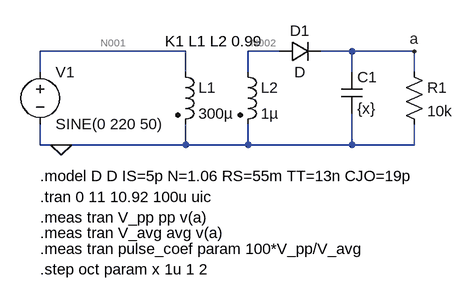
[diagram p0: schematic 1.3.1.asc]
1.3.1.asc, the LTspice schematic file:
Version 4
SHEET 1 880 680
WIRE 320 80 96 80
WIRE 464 80 416 80
WIRE 576 80 528 80
WIRE 672 80 576 80
WIRE 96 112 96 80
WIRE 320 112 320 80
WIRE 416 112 416 80
WIRE 576 112 576 80
WIRE 672 112 672 80
WIRE 96 224 96 192
WIRE 128 224 96 224
WIRE 320 224 320 192
WIRE 320 224 128 224
WIRE 416 224 416 192
WIRE 416 224 320 224
WIRE 576 224 576 176
WIRE 576 224 416 224
WIRE 672 224 672 192
WIRE 672 224 576 224
FLAG 128 224 0
FLAG 672 80 a
SYMBOL voltage 96 96 R0
WINDOW 123 0 0 Left 0
WINDOW 39 0 0 Left 0
SYMATTR InstName V1
SYMATTR Value SINE(0 220 50)
SYMBOL ind2 304 96 R0
SYMATTR InstName L1
SYMATTR Value 300µ
SYMATTR SpiceLine Rser=10m
SYMATTR Type ind
SYMBOL ind2 400 96 R0
SYMATTR InstName L2
SYMATTR Value 1µ
SYMATTR SpiceLine Rser=10m
SYMATTR Type ind
SYMBOL diode 464 96 R270
WINDOW 0 32 32 VTop 2
WINDOW 3 0 32 VBottom 2
SYMATTR InstName D1
SYMBOL cap 560 112 R0
SYMATTR InstName C1
SYMATTR Value {x}
SYMBOL res 656 96 R0
SYMATTR InstName R1
SYMATTR Value 10k
TEXT 96 272 Left 2 !.model D D IS=5p N=1.06 RS=55m TT=13n CJO=19p
TEXT 96 304 Left 2 !.tran 0 11 10.92 100u uic
TEXT 96 336 Left 2 !.meas tran V_pp pp v(a)
TEXT 96 360 Left 2 !.meas tran V_avg avg v(a)
TEXT 96 384 Left 2 !.meas tran pulse_coef param 100*V_pp/V_avg
TEXT 288 64 Left 2 !K1 L1 L2 0.99
TEXT 96 416 Left 2 !.step oct param x 1u 1 2

The netlist it stands for:
* 1.3.1.asc
V1 N001 0 SINE(0 220 50)
L1 N001 0 300µ Rser=10m
L2 N002 0 1µ Rser=10m
D1 N002 a D
C1 a 0 {x}
R1 a 0 10k
.model D D
.lib standard.dio
.model D D IS=5p N=1.06 RS=55m TT=13n CJO=19p
.tran 0 11 10.92 100u uic
.meas tran V_pp pp v(a)
.meas tran V_avg avg v(a)
.meas tran pulse_coef param 100*V_pp/V_avg
K1 L1 L2 0.99
.step oct param x 1u 1 2
.backanno
.end

* Results of the author's LTspice run, read from the files saved beside the schematic
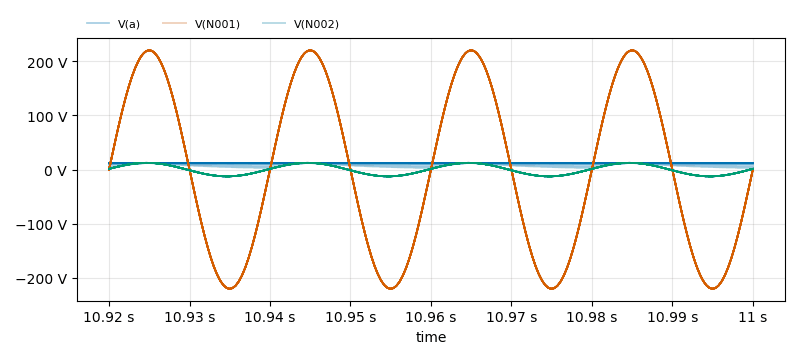
[diagram p1: Transient Analysis of 1.3.1.asc, plotted from the saved traces]
* Transient Analysis, 41 runs:
*   V(a) [run 1]: min 2.614 V, max 11.97 V, average 6.817 V, rms 7.439 V, last 2.728 V
*   V(a) [run 2]: min 5.33 V, max 11.97 V, average 8.513 V, rms 8.754 V, last 5.658 V
*   V(a) [run 3]: min 8.799 V, max 11.97 V, average 10.38 V, rms 10.43 V, last 9.168 V
*   V(a) [run 4]: min 10.67 V, max 11.96 V, average 11.32 V, rms 11.33 V, last 10.88 V
*   V(a) [run 5]: min 11.27 V, max 11.95 V, average 11.61 V, rms 11.62 V, last 11.4 V
*   V(a) [run 6]: min 11.68 V, max 11.92 V, average 11.8 V, rms 11.8 V, last 11.73 V
*   V(a) [run 7]: min 11.81 V, max 11.9 V, average 11.85 V, rms 11.85 V, last 11.83 V
*   V(a) [run 8]: min 11.84 V, max 11.88 V, average 11.86 V, rms 11.86 V, last 11.85 V
*   V(N001) [run 1]: min -220 V, max 220 V, average 24.8 mV, rms 155.6 V, last 0 V
*   V(N001) [run 2]: min -219.9 V, max 220 V, average 22.43 mV, rms 155.6 V, last 0 V
*   V(N001) [run 3]: min -219.9 V, max 220 V, average 24.39 mV, rms 155.6 V, last 0 V
*   V(N001) [run 4]: min -220 V, max 220 V, average 25.59 mV, rms 155.6 V, last 0 V
*   V(N001) [run 5]: min -220 V, max 220 V, average 26.16 mV, rms 155.6 V, last 0 V
*   V(N001) [run 6]: min -219.9 V, max 220 V, average 27.5 mV, rms 155.6 V, last 0 V
*   V(N001) [run 7]: min -219.9 V, max 220 V, average 28.15 mV, rms 155.6 V, last 0 V
*   V(N001) [run 8]: min -220 V, max 220 V, average 27.91 mV, rms 155.6 V, last 0 V
*   V(N002) [run 1]: min -12.5 V, max 12.5 V, average 1.422 mV, rms 8.84 V, last 1.319 V
*   V(N002) [run 2]: min -12.5 V, max 12.5 V, average 1.331 mV, rms 8.84 V, last 1.319 V
*   V(N002) [run 3]: min -12.5 V, max 12.5 V, average 1.434 mV, rms 8.841 V, last 1.319 V
*   V(N002) [run 4]: min -12.5 V, max 12.5 V, average 1.524 mV, rms 8.841 V, last 1.319 V
*   V(N002) [run 5]: min -12.5 V, max 12.5 V, average 1.565 mV, rms 8.841 V, last 1.319 V
*   V(N002) [run 6]: min -12.5 V, max 12.5 V, average 1.661 mV, rms 8.842 V, last 1.319 V
*   V(N002) [run 7]: min -12.5 V, max 12.5 V, average 1.713 mV, rms 8.842 V, last 1.319 V
*   V(N002) [run 8]: min -12.5 V, max 12.5 V, average 1.699 mV, rms 8.842 V, last 1.319 V
* From the log:
*   Measurement: v_pp
*     step  PP(v(a))  FROM  TO
*        1  9.35763  0  0.08
*        2  8.03088  0  0.08
*        3  6.64187  0  0.08
*        4  5.32068  0  0.08
*        5  4.15016  0  0.08
*        6  3.16899  0  0.08
*        7  2.37694  0  0.08
*        8  1.75859  0  0.08
*        9  1.28695  0  0.08
*       10  0.934093  0  0.08
*       11  0.673453  0  0.08
*       12  0.483377  0  0.08
*       13  0.345407  0  0.08
*       14  0.246269  0  0.08
*       15  0.175119  0  0.08
*       16  0.12425  0  0.08
*       17  0.088048  0  0.08
*       18  0.0623465  0  0.08
*       19  0.044116  0  0.08
*       20  0.0312004  0  0.08
*       21  0.022069  0  0.08
*       22  0.0156002  0  0.08
*       23  0.0110397  0  0.08
*       24  0.00780392  0  0.08
*       25  0.00552845  0  0.08
*       26  0.00390244  0  0.08
*       27  0.00275993  0  0.08
*       28  0.00195313  0  0.08
*       29  0.00138092  0  0.08
*       30  0.000977516  0  0.08
*       31  0.000691414  0  0.08
*       32  0.000489235  0  0.08
*       33  0.00034523  0  0.08
*       34  0.000259399  0  0.08
*       35  0.00021553  0  0.08
*       36  0.000210762  0  0.08
*       37  0.00023365  0  0.08
*       38  0.000275612  0  0.08
*       39  0.000340462  0  0.08
*       40  0.00043869  0  0.08
*     ...
*   Measurement: v_avg
*     step  AVG(v(a))  FROM  TO
*        1  6.81733  0  0.08
*        2  7.68613  0  0.08
*        3  8.51273  0  0.08
*        4  9.25031  0  0.08
*        5  9.8755  0  0.08
*        6  10.3842  0  0.08
*        7  10.7846  0  0.08
*        8  11.0916  0  0.08
*        9  11.3218  0  0.08
*       10  11.4911  0  0.08
*       11  11.6134  0  0.08
*       12  11.7003  0  0.08
*       13  11.7605  0  0.08
*       14  11.8012  0  0.08
*       15  11.8277  0  0.08
*       16  11.8439  0  0.08
*       17  11.8532  0  0.08
*       18  11.8582  0  0.08
*       19  11.8609  0  0.08
*       20  11.8623  0  0.08
*       21  11.863  0  0.08
*       22  11.8633  0  0.08
*       23  11.8635  0  0.08
*       24  11.8636  0  0.08
*       25  11.8637  0  0.08
*       26  11.8637  0  0.08
*       27  11.8637  0  0.08
*       28  11.8637  0  0.08
*       29  11.8637  0  0.08
*       30  11.8637  0  0.08
*       31  11.8637  0  0.08
*       32  11.8637  0  0.08
*       33  11.8636  0  0.08
*       34  11.8632  0  0.08
*       35  11.8619  0  0.08
*       36  11.8588  0  0.08
*       37  11.8532  0  0.08
*       38  11.8446  0  0.08
*       39  11.8325  0  0.08
*       40  11.8159  0  0.08
*     ...
*   Measurement: pulse_coef
*     step  100*v_pp/v_avg
*        1  137.263
*        2  104.485
*        3  78.0228
*        4  57.519
*        5  42.0248
*        6  30.5173
*        7  22.0401
*        8  15.8551
*        9  11.367
*       10  8.12883
*       11  5.79894
*       12  4.13133
*       13  2.937
*       14  2.08681
*       15  1.48059
*       16  1.04907
*       17  0.742823
*       18  0.525765
*       19  0.371945
*       20  0.263022
*       21  0.186032
*       22  0.131499
*       23  0.0930563
*       24  0.0657804
*       25  0.0465999
*       26  0.032894
*       27  0.0232637
*       28  0.016463
*       29  0.0116399
*       30  0.00823957
*       31  0.00582798
*       32  0.0041238
*       33  0.00290998
*       34  0.00218658
*       35  0.001817
*       36  0.00177726
*       37  0.0019712
*       38  0.00232689
*       39  0.00287734
*       40  0.0037127
*     ...